# EAGLE design keyboardAV (EAGLE 7.3.0)
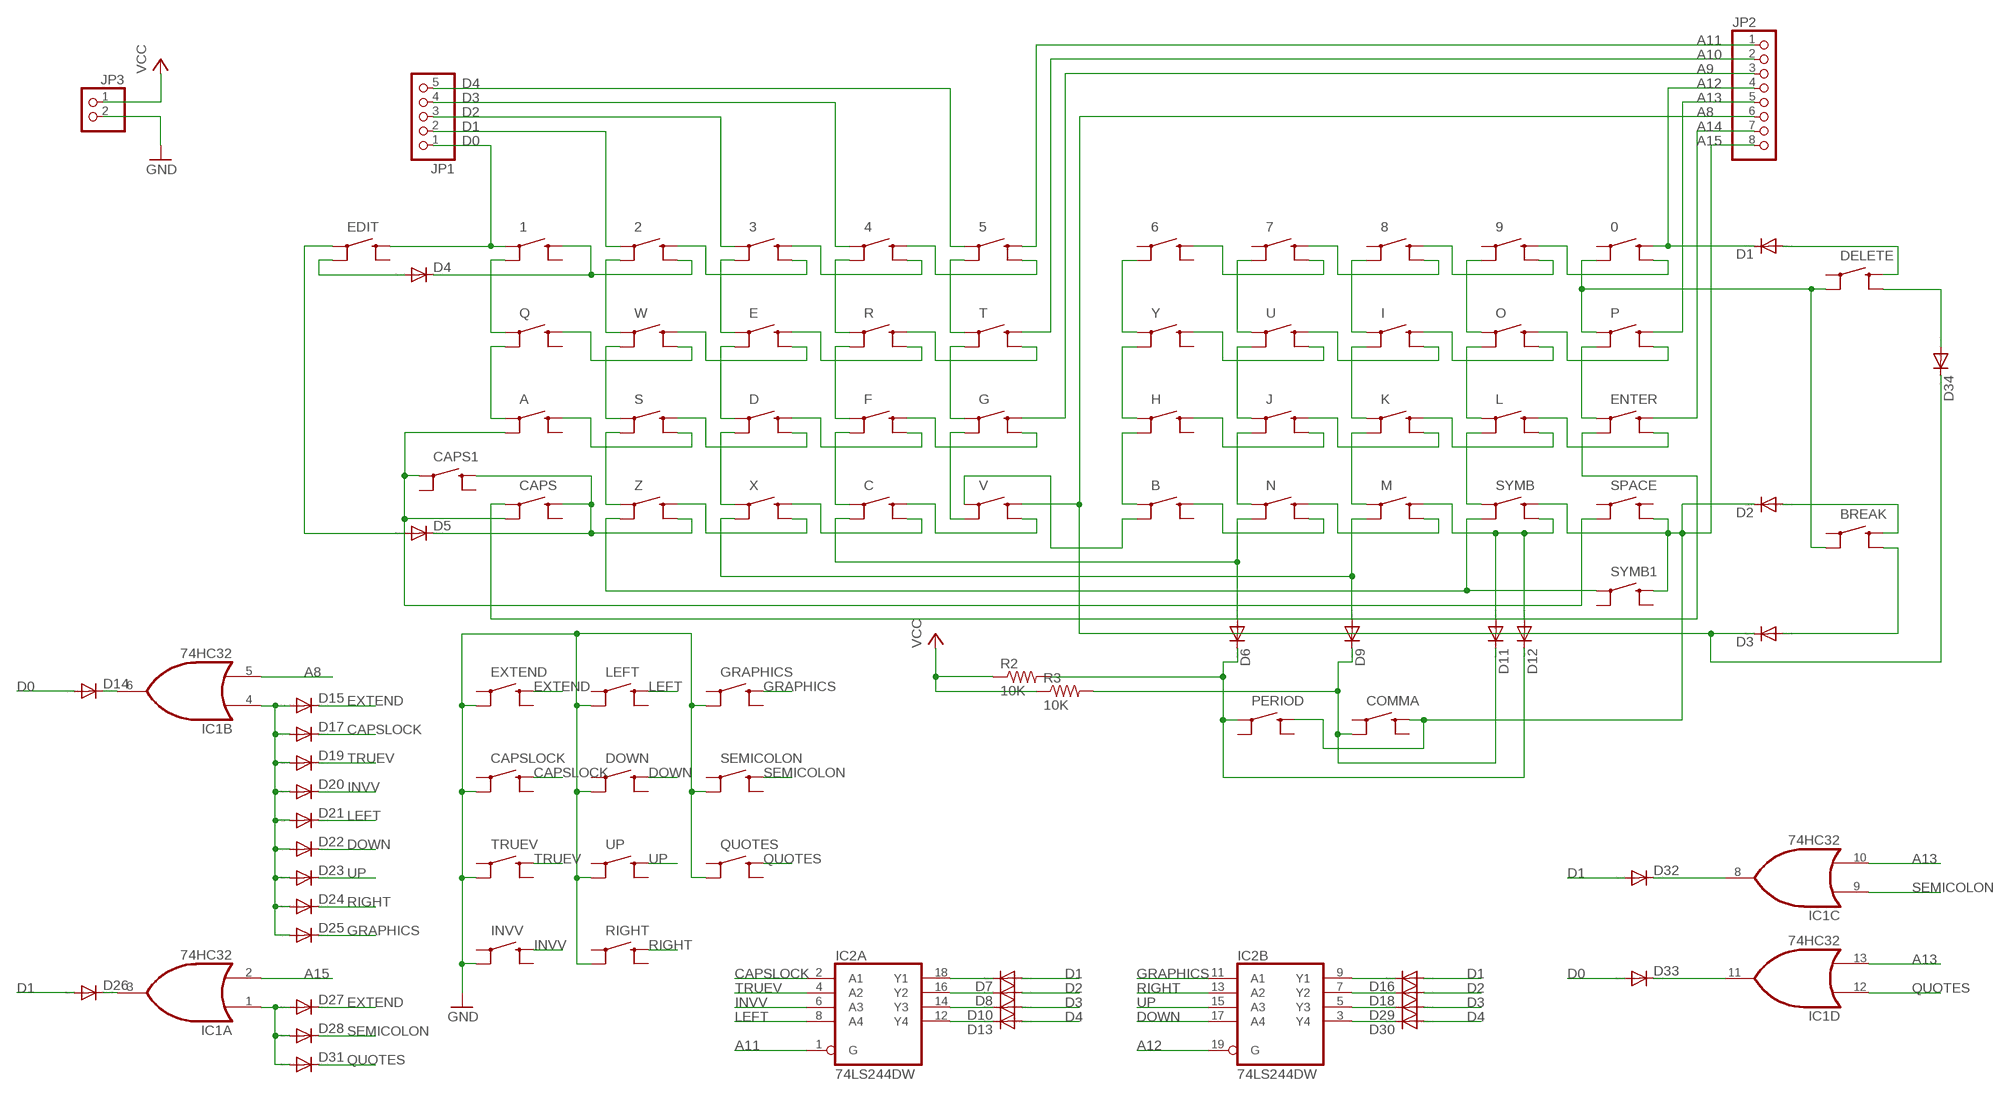
[diagram p0: schematic, sheet 1]

## Parts
0  SWITCH-MOMENTARY-2SMD  [TACTILE-SWITCH-SMD]
1  SWITCH-MOMENTARY-2SMD  [TACTILE-SWITCH-SMD]
2  SWITCH-MOMENTARY-2SMD  [TACTILE-SWITCH-SMD]
3  SWITCH-MOMENTARY-2SMD  [TACTILE-SWITCH-SMD]
4  SWITCH-MOMENTARY-2SMD  [TACTILE-SWITCH-SMD]
5  SWITCH-MOMENTARY-2SMD  [TACTILE-SWITCH-SMD]
6  SWITCH-MOMENTARY-2SMD  [TACTILE-SWITCH-SMD]
7  SWITCH-MOMENTARY-2SMD  [TACTILE-SWITCH-SMD]
8  SWITCH-MOMENTARY-2SMD  [TACTILE-SWITCH-SMD]
9  SWITCH-MOMENTARY-2SMD  [TACTILE-SWITCH-SMD]
A  SWITCH-MOMENTARY-2SMD  [TACTILE-SWITCH-SMD]
B  SWITCH-MOMENTARY-2SMD  [TACTILE-SWITCH-SMD]
BREAK  SWITCH-MOMENTARY-2SMD  [TACTILE-SWITCH-SMD]
C  SWITCH-MOMENTARY-2SMD  [TACTILE-SWITCH-SMD]
CAPS  SWITCH-MOMENTARY-2SMD  [TACTILE-SWITCH-SMD]
CAPS1  SWITCH-MOMENTARY-2SMD  [TACTILE-SWITCH-SMD]
CAPSLOCK  SWITCH-MOMENTARY-2SMD  [TACTILE-SWITCH-SMD]
COMMA  SWITCH-MOMENTARY-2SMD  [TACTILE-SWITCH-SMD]
D  SWITCH-MOMENTARY-2SMD  [TACTILE-SWITCH-SMD]
D1  DIODE-SOD323-R  [SOD323-R]
D2  DIODE-SOD323-R  [SOD323-R]
D3  DIODE-SOD323-R  [SOD323-R]
D4  DIODE-SOD323-R  [SOD323-R]
D5  DIODE-SOD323-R  [SOD323-R]
D6  DIODE-SOD323-R  [SOD323-R]
D7  DIODE-SOD323-R  [SOD323-R]
D8  DIODE-SOD323-R  [SOD323-R]
D9  DIODE-SOD323-R  [SOD323-R]
D10  DIODE-SOD323-R  [SOD323-R]
D11  DIODE-SOD323-R  [SOD323-R]
D12  DIODE-SOD323-R  [SOD323-R]
D13  DIODE-SOD323-R  [SOD323-R]
D14  DIODE-SOD323-R  [SOD323-R]
D15  DIODE-SOD323-R  [SOD323-R]
D16  DIODE-SOD323-R  [SOD323-R]
D17  DIODE-SOD323-R  [SOD323-R]
D18  DIODE-SOD323-R  [SOD323-R]
D19  DIODE-SOD323-R  [SOD323-R]
D20  DIODE-SOD323-R  [SOD323-R]
D21  DIODE-SOD323-R  [SOD323-R]
D22  DIODE-SOD323-R  [SOD323-R]
D23  DIODE-SOD323-R  [SOD323-R]
D24  DIODE-SOD323-R  [SOD323-R]
D25  DIODE-SOD323-R  [SOD323-R]
D26  DIODE-SOD323-R  [SOD323-R]
D27  DIODE-SOD323-R  [SOD323-R]
D28  DIODE-SOD323-R  [SOD323-R]
D29  DIODE-SOD323-R  [SOD323-R]
D30  DIODE-SOD323-R  [SOD323-R]
D31  DIODE-SOD323-R  [SOD323-R]
D32  DIODE-SOD323-R  [SOD323-R]
D33  DIODE-SOD323-R  [SOD323-R]
D34  DIODE-SOD323-R  [SOD323-R]
DELETE  SWITCH-MOMENTARY-2SMD  [TACTILE-SWITCH-SMD]
DOWN  SWITCH-MOMENTARY-2SMD  [TACTILE-SWITCH-SMD]
E  SWITCH-MOMENTARY-2SMD  [TACTILE-SWITCH-SMD]
EDIT  SWITCH-MOMENTARY-2SMD  [TACTILE-SWITCH-SMD]
ENTER  SWITCH-MOMENTARY-2SMD  [TACTILE-SWITCH-SMD]
EXTEND  SWITCH-MOMENTARY-2SMD  [TACTILE-SWITCH-SMD]
F  SWITCH-MOMENTARY-2SMD  [TACTILE-SWITCH-SMD]
G  SWITCH-MOMENTARY-2SMD  [TACTILE-SWITCH-SMD]
GRAPHICS  SWITCH-MOMENTARY-2SMD  [TACTILE-SWITCH-SMD]
H  SWITCH-MOMENTARY-2SMD  [TACTILE-SWITCH-SMD]
I  SWITCH-MOMENTARY-2SMD  [TACTILE-SWITCH-SMD]
IC1  74HC32  74S32D  [SO14]
IC2  74LS244DW  [SO20W]
INVV  SWITCH-MOMENTARY-2SMD  [TACTILE-SWITCH-SMD]
J  SWITCH-MOMENTARY-2SMD  [TACTILE-SWITCH-SMD]
JP1  PINHD-1X5  [1X05]
JP2  PINHD-1X8  [1X08]
JP3  PINHD-1X2  [1X02]
K  SWITCH-MOMENTARY-2SMD  [TACTILE-SWITCH-SMD]
L  SWITCH-MOMENTARY-2SMD  [TACTILE-SWITCH-SMD]
LEFT  SWITCH-MOMENTARY-2SMD  [TACTILE-SWITCH-SMD]
M  SWITCH-MOMENTARY-2SMD  [TACTILE-SWITCH-SMD]
N  SWITCH-MOMENTARY-2SMD  [TACTILE-SWITCH-SMD]
O  SWITCH-MOMENTARY-2SMD  [TACTILE-SWITCH-SMD]
P  SWITCH-MOMENTARY-2SMD  [TACTILE-SWITCH-SMD]
PERIOD  SWITCH-MOMENTARY-2SMD  [TACTILE-SWITCH-SMD]
Q  SWITCH-MOMENTARY-2SMD  [TACTILE-SWITCH-SMD]
QUOTES  SWITCH-MOMENTARY-2SMD  [TACTILE-SWITCH-SMD]
R  SWITCH-MOMENTARY-2SMD  [TACTILE-SWITCH-SMD]
R2  10K  R-US_M0805  [M0805]
R3  10K  R-US_M0805  [M0805]
RIGHT  SWITCH-MOMENTARY-2SMD  [TACTILE-SWITCH-SMD]
S  SWITCH-MOMENTARY-2SMD  [TACTILE-SWITCH-SMD]
SEMICOLON  SWITCH-MOMENTARY-2SMD  [TACTILE-SWITCH-SMD]
SPACE  SWITCH-MOMENTARY-2SMD  [TACTILE-SWITCH-SMD]
SYMB  SWITCH-MOMENTARY-2SMD  [TACTILE-SWITCH-SMD]
SYMB1  SWITCH-MOMENTARY-2SMD  [TACTILE-SWITCH-SMD]
T  SWITCH-MOMENTARY-2SMD  [TACTILE-SWITCH-SMD]
TRUEV  SWITCH-MOMENTARY-2SMD  [TACTILE-SWITCH-SMD]
U  SWITCH-MOMENTARY-2SMD  [TACTILE-SWITCH-SMD]
UP  SWITCH-MOMENTARY-2SMD  [TACTILE-SWITCH-SMD]
V  SWITCH-MOMENTARY-2SMD  [TACTILE-SWITCH-SMD]
W  SWITCH-MOMENTARY-2SMD  [TACTILE-SWITCH-SMD]
X  SWITCH-MOMENTARY-2SMD  [TACTILE-SWITCH-SMD]
Y  SWITCH-MOMENTARY-2SMD  [TACTILE-SWITCH-SMD]
Z  SWITCH-MOMENTARY-2SMD  [TACTILE-SWITCH-SMD]

## Nets
A8: D3.C D34.C IC1.5(B:I1) JP2.6 V.3
A9: G.3 JP2.3
A10: JP2.2 T.3
A11: 5.3 IC2.1(A:G) JP2.1
A12: 0.3 D1.C IC2.19(B:G) JP2.4
A13: IC1.10(C:I1) IC1.13(D:I1) JP2.5 P.3
A14: ENTER.3 JP2.7
A15: COMMA.3 D2.C IC1.2(A:I1) JP2.8 PERIOD.3 SPACE.4 SYMB1.3 SYMB.3
CAPSLOCK: CAPSLOCK.3 D17.C IC2.2(A:A1)
D0: 1.1 D14.A D33.A EDIT.3 JP1.1
D1: 2.1 D7.A D16.A D26.A D32.A JP1.2
D2: 3.1 D8.A D18.A JP1.3
D3: 4.1 D10.A D29.A JP1.4
D4: 5.1 D13.A D30.A JP1.5
DOWN: D22.C DOWN.3 IC2.17(B:A4)
EXTEND: D15.C D27.C EXTEND.3
GND: CAPSLOCK.2 DOWN.2 EXTEND.2 GRAPHICS.2 INVV.2 JP3.2 LEFT.2 QUOTES.2 RIGHT.2 SEMICOLON.2 TRUEV.2 UP.2
GRAPHICS: D25.C GRAPHICS.3 IC2.11(B:A1)
INVV: D20.C IC2.6(A:A3) INVV.3
LEFT: D21.C IC2.8(A:A4) LEFT.3
N$1: D4.A EDIT.2
N$2: D5.A EDIT.1
N$3: BREAK.3 D2.A
N$4: BREAK.4 D3.A
N$5: D1.A DELETE.3
N$6: 1.2 Q.1
N$7: A.1 Q.2
N$9: CAPS.1 ENTER.2
N$10: B.1 H.2
N$11: H.1 Y.2
N$12: 6.2 Y.1
N$13: 2.2 W.1
N$14: S.1 W.2
N$15: S.2 Z.1
N$16: SYMB1.1 SYMB.2 Z.2
N$17: D9.A M.2 X.2
N$18: C.2 D6.A N.2
N$19: B.2 V.1
N$20: 3.2 E.1
N$21: D.1 E.2
N$22: D.2 X.1
N$23: 4.2 R.1
N$24: F.1 R.2
N$25: C.1 F.2
N$26: 5.2 T.1
N$27: G.1 T.2
N$28: G.2 V.2
N$29: 3.3 4.4
N$30: 4.3 5.4
N$31: 2.3 3.4
N$32: 1.3 2.4 D4.C
N$33: C.3 V.4
N$34: R.3 T.4
N$35: E.3 R.4
N$36: E.4 W.3
N$37: Q.3 W.4
N$38: F.3 G.4
N$39: D.3 F.4
N$40: D.4 S.3
N$41: A.3 S.4
N$42: 0.4 9.3
N$43: J.2 N.1
N$44: J.1 U.2
N$45: 7.2 U.1
N$46: K.2 M.1
N$47: I.2 K.1
N$48: 8.2 I.1
N$49: L.2 SYMB.1
N$50: L.1 O.2
N$51: 9.2 O.1
N$53: ENTER.1 P.2
N$54: 0.2 BREAK.2 DELETE.2 P.1
N$55: 8.3 9.4
N$56: 7.3 8.4
N$57: 6.3 7.4
N$58: C.4 X.3
N$59: X.4 Z.3
N$60: CAPS1.3 CAPS.3 D5.C Z.4
N$61: O.3 P.4
N$62: I.3 O.4
N$63: I.4 U.3
N$64: U.4 Y.3
N$65: ENTER.4 L.3
N$66: K.3 L.4
N$67: J.3 K.4
N$68: H.3 J.4
N$70: D11.A D12.A M.3 SYMB.4
N$71: M.4 N.3
N$72: B.3 N.4
N$73: D34.A DELETE.4
N$74: D7.C IC2.18(A:Y1)
N$75: D8.C IC2.16(A:Y2)
N$77: D10.C IC2.14(A:Y3)
N$79: D6.C D12.C PERIOD.1 R2.2
N$80: D13.C IC2.12(A:Y4)
N$81: D16.C IC2.9(B:Y1)
N$83: COMMA.2 D9.C D11.C R3.2
N$84: D14.C IC1.6(B:O)
N$85: D18.C IC2.7(B:Y2)
N$86: D26.C IC1.3(A:O)
N$87: D27.A D28.A D31.A IC1.1(A:I0)
N$88: D29.C IC2.5(B:Y3)
N$89: D30.C IC2.3(B:Y4)
N$90: D15.A D17.A D19.A D20.A D21.A D22.A D23.A D24.A D25.A IC1.4(B:I0)
N$91: A.2 CAPS1.1 CAPS.2 SPACE.2
N$108: D32.C IC1.8(C:O)
N$114: D33.C IC1.11(D:O)
QUOTES: D31.C IC1.12(D:I0) QUOTES.3
RIGHT: D24.C IC2.13(B:A2) RIGHT.3
SEMICOLON: D28.C IC1.9(C:I0) SEMICOLON.3
TRUEV: D19.C IC2.4(A:A2) TRUEV.3
UP: D23.C IC2.15(B:A3) UP.3
VCC: JP3.1 R2.1 R3.1
Unconnected: 0.1 1.4 6.1 6.4 7.1 8.1 9.1 A.4 B.4 BREAK.1 CAPS1.2 CAPS1.4 CAPS.4 CAPSLOCK.1 CAPSLOCK.4 COMMA.1 COMMA.4 DELETE.1 DOWN.1 DOWN.4 EDIT.4 EXTEND.1 EXTEND.4 GRAPHICS.1 GRAPHICS.4 H.4 INVV.1 INVV.4 LEFT.1 LEFT.4 PERIOD.2 PERIOD.4 Q.4 QUOTES.1 QUOTES.4 RIGHT.1 RIGHT.4 SEMICOLON.1 SEMICOLON.4 SPACE.1 SPACE.3 SYMB1.2 SYMB1.4 TRUEV.1 TRUEV.4 UP.1 UP.4 Y.4

## Power pins joined to a net without a drawn wire
GND: IC1.7(P:GND) IC2.10(P:GND)
VCC: IC1.14(P:VCC) IC2.20(P:VCC)

## Library data of the parts
0 1-9 A B BREAK C CAPS CAPS1 CAPSLOCK COMMA D DELETE DOWN E EDIT ENTER EXTEND F G GRAPHICS H I INVV J K L LEFT M N O P PERIOD Q QUOTES R RIGHT S SEMICOLON SPACE SYMB SYMB1 T TRUEV U UP V W X Y Z = SparkFun-Electromechanical:SWITCH-MOMENTARY-2: Various NO switches- pushbuttons, reed, etc; PROD_ID: SWCH-08247
D1-D34 = diode:DIODE-: DIODE
IC1 = 74xx-us:74*32: Quad 2-input OR gate
IC2 = 74xx-us:74*244: Octal BUFFER and LINE DRIVER, 3-state
JP1 = pinhead:PINHD-1X5: PIN HEADER
JP2 = pinhead:PINHD-1X8: PIN HEADER
JP3 = pinhead:PINHD-1X2: PIN HEADER
R2 R3 = rcl:R-US_: RESISTOR, American symbol

## Board
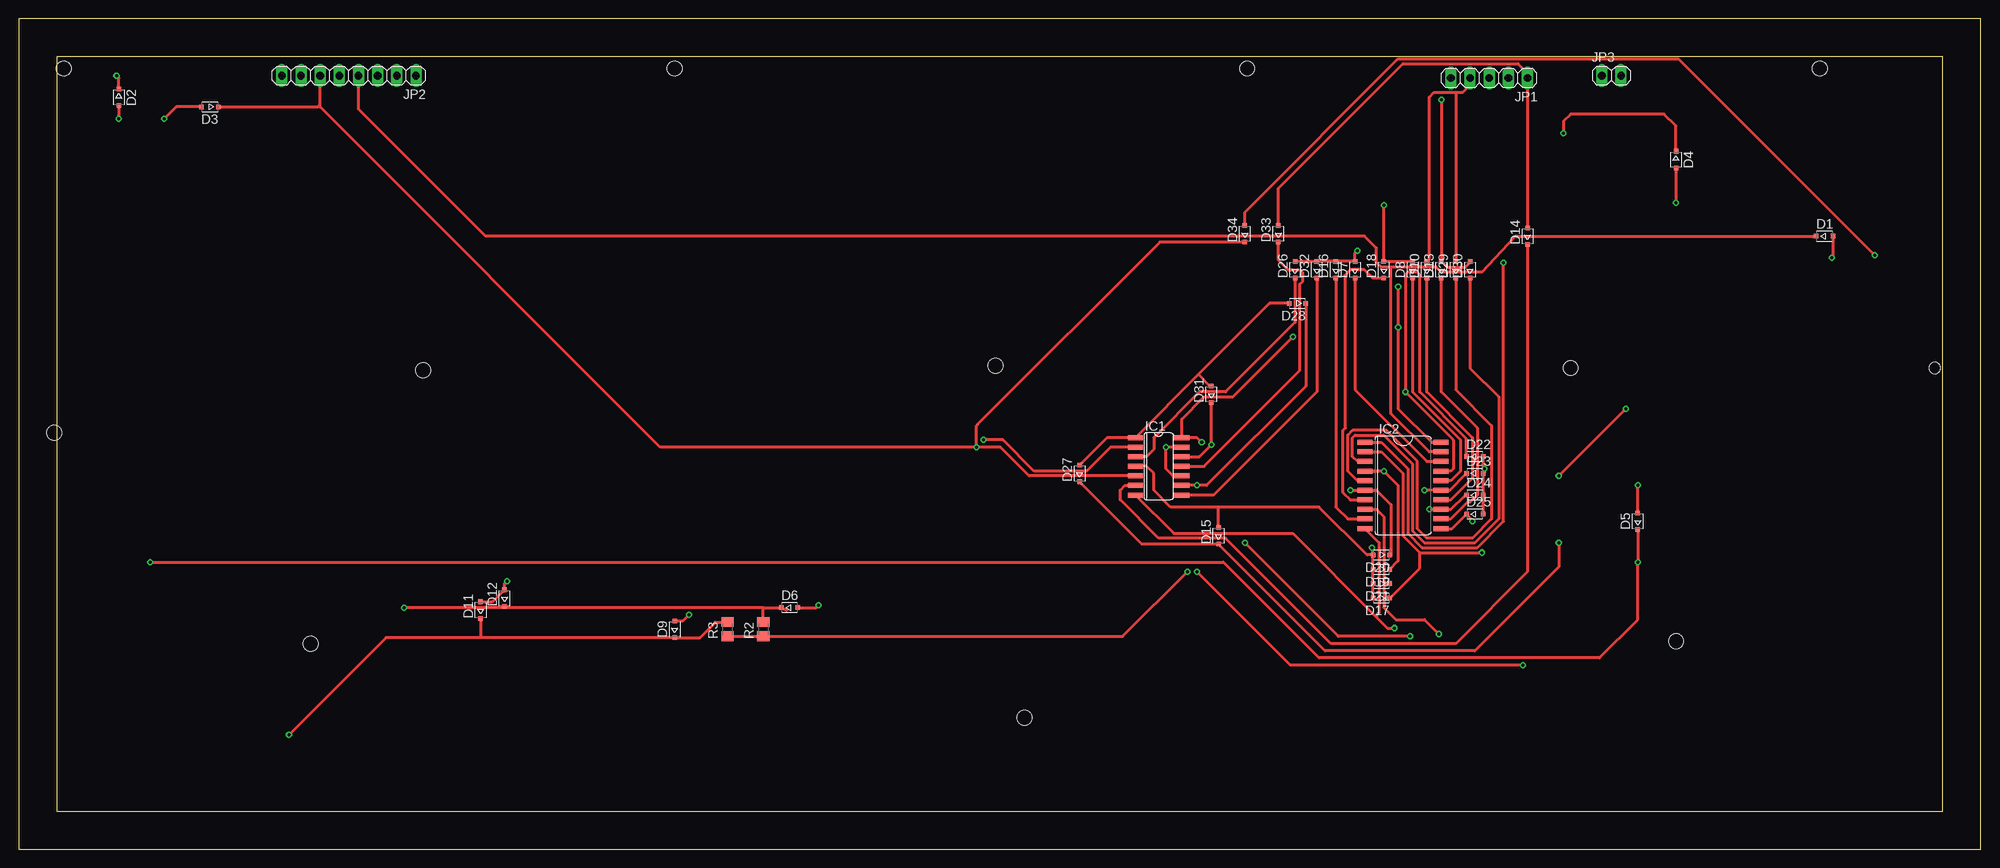
[diagram p1: board, top side]
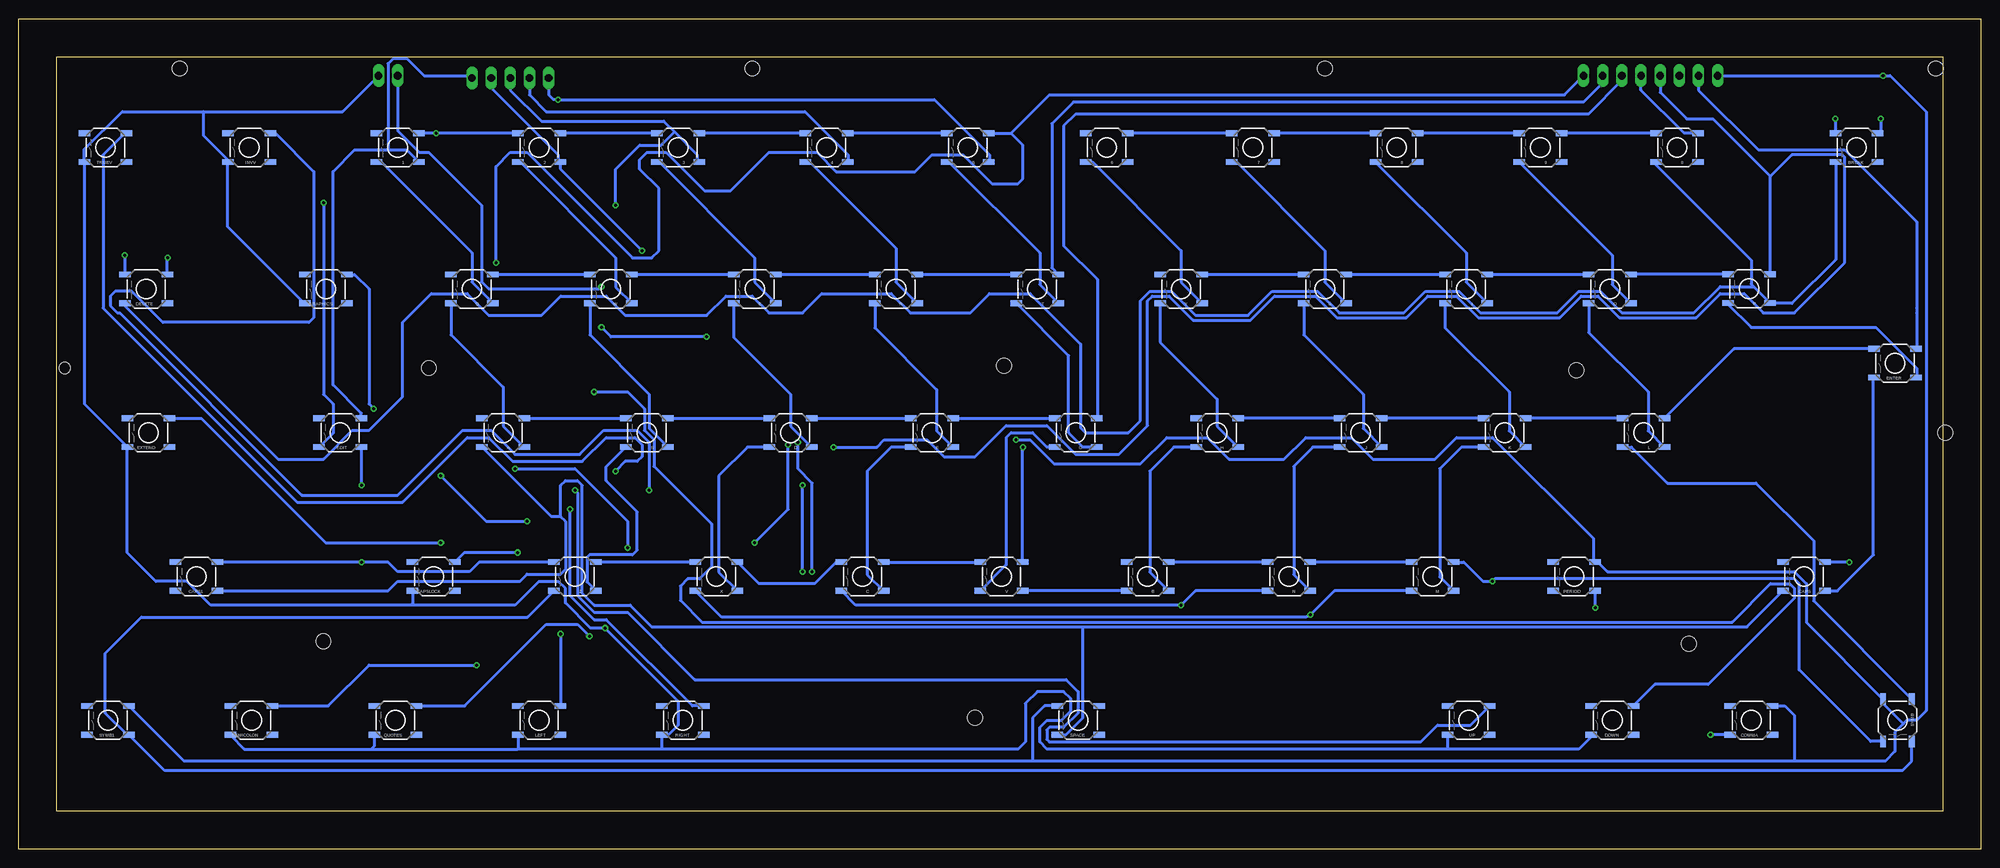
[diagram p2: board, bottom side, seen from below]

Size 260 x 110 mm. Coordinates in mm from the lower left corner, seen from the top.
Outline: 0,0 260,0 260,110 0,110 0,0
Copper layers (1*16): Top 0.035mm / dielectric 1.5mm / Bottom 0.035mm
Design rules "default": minimum track width 10mil, minimum drill 24mil, track to track 8mil, track to pad 8mil, pad to pad 8mil, via to via 8mil, smd to smd 8mil, copper to edge 40mil, drill to drill 8mil, minimum pad ring 10mil, minimum via ring 8mil, stop-mask expansion 4mil, vias tented up to drill 0mil, thermal gap 10mil
Holes 2 mm at 38.66,27.23 133.27,17.38 219.63,27.54 205.66,63.74 129.46,64.06 53.58,63.42 5.95,103.42 86.92,103.42 162.8,103.42 238.68,103.42 4.68,55.16
Holes 1.5 mm at 253.92,63.74
Milling: 4 lines

### Footprints (pad centres in the part's own frame; a part is rotated, then mirrored left to right if it is on the bottom)
TACTILE-SWITCH-SMD = smd 1.524 x 0.762: 1 -2.794,1.905; 2 2.794,1.905; 3 -2.794,-1.905; 4 2.794,-1.905
SOD323-R = smd 0.6 x 0.6: A 1.1,0; C -1.1,0
SO14 = smd 0.66 x 2.032: 1 -3.81,-3.073; 2 -2.54,-3.073; 3 -1.27,-3.073; 4 0,-3.073; 5 1.27,-3.073; 6 2.54,-3.073; 7 3.81,-3.073; 8 3.81,3.073; 9 2.54,3.073; 10 1.27,3.073; 11 0,3.073; 12 -1.27,3.073; 13 -2.54,3.073; 14 -3.81,3.073
SO20W = smd 0.66 x 2.032: 1 -5.715,-5.029; 2 -4.445,-5.029; 3 -3.175,-5.029; 4 -1.905,-5.029; 5 -0.635,-5.029; 6 0.635,-5.029; 7 1.905,-5.029; 8 3.175,-5.029; 9 4.445,-5.029; 10 5.715,-5.029; 11 5.715,5.029; 12 4.445,5.029; 13 3.175,5.029; 14 1.905,5.029; 15 0.635,5.029; 16 -0.635,5.029; 17 -1.905,5.029; 18 -3.175,5.029; 19 -4.445,5.029; 20 -5.715,5.029
1X05 = drill 1.016 long: 1 -5.08,0; 2 -2.54,0; 3 0,0; 4 2.54,0; 5 5.08,0
1X08 = drill 1.016 long: 1 -8.89,0; 2 -6.35,0; 3 -3.81,0; 4 -1.27,0; 5 1.27,0; 6 3.81,0; 7 6.35,0; 8 8.89,0
1X02 = drill 1.016 long: 1 -1.27,0; 2 1.27,0
M0805 = smd 1.3 x 1.6: 1 -0.95,0; 2 0.95,0

### Placement (x,y rotation side)
0  40.24,92.95 180 bottom
1  209.79,92.95 180 bottom
2  191.06,92.95 180 bottom
3  172.64,92.95 180 bottom
4  152.96,92.95 180 bottom
5  134.22,92.95 180 bottom
6  115.81,92.95 180 bottom
7  96.44,92.95 180 bottom
8  77.39,92.95 180 bottom
9  58.34,92.95 180 bottom
A  195.82,55.16 180 bottom
B  110.41,36.11 180 bottom
BREAK  16.43,92.95 180 bottom
C  148.19,36.11 180 bottom
CAPS  23.41,36.11 180 bottom
CAPS1  236.46,36.11 180 bottom
CAPSLOCK  205.03,36.11 180 bottom
COMMA  30.4,17.06 180 bottom
D  157.72,55.16 180 bottom
D1  239.31,81.2 0 top
D2  13.26,99.61 270 top
D3  25.32,98.34 180 top
D4  219.63,91.36 270 top
D5  214.55,43.42 90 top
D6  102.16,31.99 0 top
D7  177.09,76.75 90 top
D8  184.71,76.75 90 top
D9  86.92,29.13 90 top
D10  186.61,76.75 90 top
D11  61.2,31.67 90 top
D12  64.37,33.26 90 top
D13  188.51,76.75 90 top
D14  199.94,81.2 90 top
D15  158.99,41.51 90 top
D16  174.54,76.75 90 top
D17  180.58,33.26 180 top
D18  180.9,76.75 90 top
D19  180.58,37.07 180 top
D20  180.58,38.97 180 top
D21  180.58,35.16 180 top
D22  192.96,51.99 0 top
D23  192.96,49.77 0 top
D24  192.96,46.91 0 top
D25  192.96,44.37 0 top
D26  169.15,76.75 90 top
D27  140.57,49.77 90 top
D28  169.47,72.31 180 top
D29  190.42,76.75 90 top
D30  192.32,76.75 90 top
D31  158.03,60.24 90 top
D32  172,76.75 90 top
D33  166.93,81.52 90 top
D34  162.48,81.52 90 top
DELETE  243.12,74.22 180 bottom
DOWN  48.81,17.06 180 bottom
E  162.48,74.22 180 bottom
EDIT  217.41,55.16 180 bottom
ENTER  11.35,64.37 180 bottom
EXTEND  242.81,55.16 180 bottom
F  138.99,55.16 180 bottom
G  119.94,55.16 180 bottom
GRAPHICS  219.31,74.22 180 bottom
H  101.2,55.16 180 bottom
I  68.18,74.22 180 bottom
IC1  151.05,50.72 270 top
IC2  183.44,48.18 270 top
INVV  229.47,92.95 180 bottom
J  82.15,55.16 180 bottom
JP1  194.87,102.16 180 top
JP2  43.73,102.47 180 top
JP3  211.06,102.47 0 top
K  63.1,55.16 180 bottom
L  44.69,55.16 180 bottom
LEFT  191.06,17.06 180 bottom
M  72.63,36.11 180 bottom
N  91.68,36.11 180 bottom
O  49.13,74.22 180 bottom
P  30.69,74.25 180 bottom
PERIOD  53.9,36.11 180 bottom
Q  199.94,74.22 180 bottom
QUOTES  210.1,17.06 180 bottom
R  143.75,74.22 180 bottom
R2  98.66,29.13 90 top
R3  93.9,29.13 90 top
RIGHT  172,17.06 180 bottom
S  176.77,55.16 180 bottom
SEMICOLON  229.16,17.06 180 bottom
SPACE  119.62,17.06 180 bottom
SYMB  11.03,17.06 270 bottom
SYMB1  248.21,17.06 180 bottom
T  125.02,74.22 180 bottom
TRUEV  248.52,92.95 180 bottom
U  86.92,74.22 180 bottom
UP  67.87,17.06 180 bottom
V  129.78,36.11 180 bottom
W  181.53,74.22 180 bottom
X  167.56,36.11 180 bottom
Y  105.97,74.22 180 bottom
Z  186.29,36.11 180 bottom

### Tracks (layer width: path | path; a pad name or v marks a point on that pad's centre or on a via)
A8  (via drill 0.4)
  Top 0.406: v126.92,53.26 85.01,53.26 39.92,98.34 39.92,98.66 | 39.92,98.66 JP2.6 | D3.C 39.61,98.34 39.92,98.66 | IC1.5 133.91,49.45 130.09,53.26 v126.92,53.26 | D34.C 151.22,80.42 127.08,56.28 126.92,56.12 v126.92,53.26
  Bottom 0.406: V.3 126.98,53.2 v126.92,53.26
A9
  Bottom 0.406: JP2.3 47.55,101.84 51.99,97.39 119.94,97.39 121.52,95.81 121.52,79.93 117.08,75.48 117.08,57.13 G.3
A10
  Bottom 0.406: JP2.2 50.09,101.52 52.62,98.98 120.25,98.98 123.11,96.12 123.11,77.01 T.3
A11  (via drill 0.4)
  Top 0.406: IC2.1 180.58,53.9 184.07,50.4 184.07,41.83 185.97,39.92 193.28,39.92 196.77,43.42 v196.77,77.71
  Bottom 0.406: 5.3 128.51,94.85 | 128.51,94.85 123.43,99.93 55.16,99.93 JP2.1 | v196.77,77.71 196.77,90.41 194.87,92.31 192.64,92.31 178.67,78.34 176.13,78.34 175.18,79.3 175.18,87.55 177.72,90.09 177.72,91.36 176.77,92.31 174.23,92.31 169.15,87.23 165.66,87.23 160.57,92.31 154.22,92.31 151.69,89.77 141.21,89.77 138.99,92 134.86,92 131.05,88.19 127.56,88.19 126.92,88.82 126.92,93.27 128.51,94.85
A12
  Top 0.406: JP2.4 45.01,98.03 61.83,81.2 178.35,81.2 179.94,79.61 179.94,77.71 180.58,77.07 181.85,77.07 | D1.C 198.36,81.2 193.91,76.44 188.51,76.44 187.88,77.07 181.85,77.07 | IC2.19 186.93,52.62 181.85,57.7 181.85,77.07
  Bottom 0.406: 0.3 39.29,94.85 45.01,100.57 JP2.4
A13  (via drill 0.4)
  Top 0.406: IC1.13 v152,53.26 152,50.4 152.96,49.45 IC1.10
  Bottom 0.406: JP2.5 42.47,100.25 38.97,96.76 35.48,96.76 27.86,89.14 | P.3 27.89,89.11 27.86,89.14 | v152,53.26 146.29,53.26 145.34,54.21 139.62,54.21 137.4,51.99 133.27,51.99 129.14,56.12 123.75,56.12 119.94,52.31 114.22,52.31 110.41,56.12 110.41,72.63 109.78,73.26 107.55,73.26 104.38,70.09 96.76,70.09 93.58,73.26 88.19,73.26 85.33,70.41 76.12,70.41 73.26,73.26 69.45,73.26 66.59,70.41 55.8,70.41 52.94,73.26 50.72,73.26 47.86,70.41 37.7,70.41 34.53,73.58 31.35,73.58 28.81,71.04 24.68,71.04 18.02,77.71 18.02,91.68 18.34,92 25,92 27.86,89.14
A14
  Bottom 0.406: JP2.7 37.38,100.57 29.45,92.63 18.02,92.63 8.49,83.11 8.49,71.67 8.49,71.04 8.49,66.34 ENTER.3
A15  (via drill 0.4)
  Top 0.406: D2.C 13.26,102.16 v12.94,102.47 | IC1.2 144.7,53.26 141.53,50.09 134.54,50.09 130.41,54.21 v127.87,54.21
  Bottom 0.406: JP2.8 v12.94,102.47 11.98,102.47 7.22,97.71 7.22,18.34 8.49,17.06 9.76,17.06 10.24,16.59 | 10.24,16.59 11.35,15.48 11.35,12.94 12.62,11.67 24.68,11.67 | 10.24,16.59 12.94,19.29 SYMB.3 23.1,30.02 23.1,35.16 24.68,36.75 49.45,36.75 50.72,38.02 PERIOD.3 51.35,38.27 51.35,41.2 64.69,54.53 69.45,54.53 72.31,51.67 80.56,51.67 83.42,54.53 89.45,54.53 92.31,51.67 99.61,51.67 102.47,54.53 107.87,54.53 111.36,51.04 122.79,51.04 125.97,54.21 v127.87,54.21 | 24.68,11.67 125.65,11.67 | 125.65,11.67 238.11,11.67 SYMB1.3 | 125.65,11.67 125.65,17.38 124.06,18.97 SPACE.4 | 24.68,11.67 24.68,17.7 25.95,18.97 COMMA.3
CAPSLOCK  (via drill 0.4)
  Top 0.406: IC2.2 180.58,52.62 183.44,49.77 183.44,41.51 185.66,39.29 | 185.66,39.29 v193.91,39.29 | D17.C 185.66,37.24 185.66,39.29
  Bottom 0.406: 201.85,38.02 CAPSLOCK.3 200.96,39.29 v193.91,39.29
D0
  Top 0.406: D33.A 166.93,87.55 183.44,104.06 198.68,104.06 199.94,102.79 JP1.1 D14.A
  Bottom 0.406: EDIT.3 214.61,57.77 218.36,61.52 218.36,89.77 215.5,92.63 211.06,92.63 | 211.06,92.63 208.58,92.63 1.1 | 211.06,92.63 211.06,104.06 210.42,104.69 208.52,104.69 206.29,102.47 200.26,102.47 JP1.1
D1  (via drill 0.4)
  Top 0.406: v177.4,79.3 177.09,78.98 D7.A D16.A D32.A D26.A
  Bottom 0.406: JP1.2 197.41,100.89 188.51,92 188.51,91.3 2.1 188.26,90.15 v177.4,79.3
D2  (via drill 0.4)
  Top 0.406: D8.A D18.A v180.9,85.33
  Bottom 0.406: JP1.3 194.87,100.57 190.74,96.44 174.54,96.44 173.12,95.01 | 173.12,95.01 170.1,92 170.1,91.3 3.1 | v180.9,85.33 180.9,90.09 177.72,93.27 174.86,93.27 173.12,95.01
D3
  Top 0.406: D10.A 186.93,78.17 186.93,99.61 187.56,100.25 190.42,100.25 | 190.42,100.25 191.37,100.25 192.32,101.2 JP1.4 | 190.42,100.25 D29.A
  Bottom 0.406: JP1.4 192.32,99.93 190.1,97.71 155.81,97.71 150.1,92 150.1,91.11 4.1
D4  (via drill 0.4)
  Top 0.406: v188.51,99.3 D13.A 189.3,77.07 191.69,77.07 192.32,77.71 D30.A
  Bottom 0.406: JP1.5 189.78,99.93 189.15,99.3 v188.51,99.3 138.67,99.3 131.37,92 131.37,91.11 5.1
DOWN  (via drill 0.4)
  Top 0.406: D22.C 191.86,54.36 185.66,60.56 185.66,76.12 185.34,76.44 184.07,76.44 183.75,76.12 v183.75,60.56 190.1,54.21 190.1,50.4 189.78,50.09 IC2.17
  Bottom 0.406: v183.75,60.56 179.31,60.56 177.09,58.34 177.09,55.48 175.81,54.21 175.81,50.72 168.19,43.1 168.19,37.38 169.78,35.8 171.37,35.8 172.32,34.84 172.32,32.94 169.47,30.08 32.94,30.08 27.86,35.16 25.32,35.16 24.68,34.53 24.68,33.26 36.11,21.83 43.16,21.83 DOWN.3
EXTEND  (via drill 0.4)
  Top 0.406: D27.C 148.83,40.41 D15.C 173.13,26.27 192.96,26.27 204.07,37.38 v204.07,40.56
  Bottom 0.406: EXTEND.3 235.82,57.07 219.31,40.56 v204.07,40.56
GND  (via drill 0.4)
  Top 0.406: IC1.7 153.06,41.83 168.83,41.83 179.94,30.72 | 179.94,30.72 181.37,29.29 v182.32,29.29 | IC2.10 180.26,40.61 180.26,31.35 179.94,31.04 179.94,30.72
  Bottom 0.406: 235.5,97.71 246.3,97.71 251.32,92.69 TRUEV.2 251.32,58.98 EXTEND.2 245.66,53.2 245.66,39.29 241.85,35.48 237.73,35.48 234.55,32.3 207.56,32.3 | 235.5,97.71 217.09,97.71 JP3.2 | 235.5,97.71 235.5,94.53 232.27,91.3 INVV.2 232.33,90.98 232.33,82.47 222.17,72.31 GRAPHICS.2 | SEMICOLON.2 231.95,15.1 230.11,13.26 213.28,13.26 | 213.28,13.26 193.91,13.26 | LEFT.2 193.85,13.32 193.91,13.26 | QUOTES.2 212.9,13.64 213.28,13.26 | RIGHT.2 174.86,15.16 | 207.56,32.3 194.23,32.3 191.06,35.48 188.51,35.48 187.56,34.53 187.56,32.62 184.23,29.29 v182.32,29.29 172.64,19.61 172.64,16.43 173.91,15.16 RIGHT.2 | CAPSLOCK.2 207.82,32.56 207.56,32.3 | DOWN.2 51.61,14.91 53.26,13.26 70.72,13.26 | 70.72,13.26 123.75,13.26 124.7,14.21 124.7,16.11 123.75,17.06 121.84,17.06 120.57,18.34 120.57,19.92 121.52,20.88 125.02,20.88 126.6,19.29 126.6,14.21 127.56,13.26 174.86,13.26 | 174.86,13.26 193.91,13.26 | RIGHT.2 174.8,13.32 174.86,13.26 | 70.72,13.26 70.66,13.32 UP.2
GRAPHICS  (via drill 0.4)
  Top 0.406: IC2.11 189.96,42.47 D25.C 192.64,43.59 v192.64,43.42 | v212.96,58.34 v204.07,49.45
  Bottom 0.406: GRAPHICS.3 215.5,76.12 213.6,74.22 213.6,58.98 v212.96,58.34 | v204.07,49.45 198.04,43.42 v192.64,43.42
INVV  (via drill 0.4)
  Top 0.406: D20.C 181.85,38.8 181.85,45.64 179.94,47.55 IC2.6 v176.45,47.55
  Bottom 0.406: INVV.3 225.98,94.85 220.9,89.77 220.9,70.41 221.53,69.77 240.9,69.77 245.03,73.9 247.25,73.9 247.89,73.26 247.89,71.99 246.94,71.04 246.62,71.04 222.49,46.91 209.79,46.91 201.22,55.48 197.41,55.48 194.23,52.31 185.66,52.31 182.48,55.48 178.04,55.48 176.45,53.9 v176.45,47.55
LEFT  (via drill 0.4)
  Top 0.406: IC2.8 179.94,45.01 180.9,44.05 180.9,35.16 | D21.C 180.9,35.16 | 180.9,35.16 180.9,31.99 182.48,30.4 186.29,30.4 v188.2,28.5
  Bottom 0.406: v188.2,28.5 188.2,19.03 LEFT.3
N$1  (via drill 0.4)
  Top 0.406: D4.A v219.63,85.64
  Bottom 0.406: v219.63,85.64 219.63,60.24 218.36,58.98 218.36,55.1 EDIT.2
N$2  (via drill 0.4)
  Top 0.406: D5.A v214.55,48.18
  Bottom 0.406: v214.55,48.18 214.55,53.2 EDIT.1
N$3  (via drill 0.4)
  Top 0.406: D2.A v13.26,96.76
  Bottom 0.406: v13.26,96.76 13.26,95.23 BREAK.3
N$4  (via drill 0.4)
  Top 0.406: D3.A 20.88,98.34 v19.29,96.76
  Bottom 0.406: v19.29,96.76 19.29,94.92 BREAK.4
N$5  (via drill 0.4)
  Top 0.406: D1.A 240.41,78.49 v240.27,78.34
  Bottom 0.406: DELETE.3 240.33,78.03 | 240.33,78.03 240.33,78.28 v240.27,78.34 240.27,78.09 240.33,78.03
N$6
  Bottom 0.406: 1.2 212.01,91.04 199.94,78.98 199.94,75.1 Q.1
N$7
  Bottom 0.406: Q.2 202.74,68.12 195.82,61.2 195.82,56.05 A.1
N$9
  Bottom 0.406: CAPS.1 18.97,34.21 14.21,38.97 14.21,62.4 ENTER.2
N$10
  Bottom 0.406: H.2 106.92,53.26 110.09,50.09 110.09,36.69 B.1
N$11
  Bottom 0.406: Y.2 108.76,67.17 101.2,59.61 101.2,56.05 H.1
N$12
  Bottom 0.406: 6.2 117.71,91.04 105.97,79.3 105.97,75.1 Y.1
N$13
  Bottom 0.406: 2.2 193.59,91.04 180.9,78.34 180.9,74.47 W.1
N$14
  Bottom 0.406: W.2 184.32,68.12 176.45,60.24 176.45,55.74 S.1
N$15
  Bottom 0.406: S.2 182.16,50.66 182.16,48.81 178.04,44.69 178.04,39.61 178.67,38.97 184.39,38.97 184.71,38.66 184.71,35.42 Z.1
N$16
  Bottom 0.406: Z.2 192.58,30.72 243.76,30.72 248.52,25.95 248.52,18.02 245.66,15.16 SYMB1.1 240.65,10.4 10.4,10.4 9.13,11.67 SYMB.2
N$17  (via drill 0.4)
  Top 0.406: D9.A 88.02,30.23 v88.82,31.04
  Bottom 0.406: M.2 85.64,34.21 v88.82,31.04 89.45,30.72 166.86,30.72 X.2
N$18  (via drill 0.4)
  Top 0.406: D6.A 105.65,31.99 v105.97,32.3
  Bottom 0.406: N.2 104.06,34.21 v105.97,32.3 149.08,32.3 C.2
N$19
  Bottom 0.406: B.2 V.1
N$20
  Bottom 0.406: 3.2 175.18,91.04 162.48,78.34 162.48,75.1 E.1
N$21
  Bottom 0.406: E.2 165.27,67.8 157.72,60.24 157.72,56.05 D.1
N$22
  Bottom 0.406: D.2 163.43,53.26 167.24,49.45 167.24,36.69 X.1
N$23
  Bottom 0.406: 4.2 155.18,91.04 143.75,79.61 143.75,75.1 R.1
N$24
  Bottom 0.406: R.2 146.54,69.07 138.35,60.88 138.35,55.42 F.1
N$25
  Bottom 0.406: F.2 144.38,53.26 147.56,50.09 147.56,36.37 C.1
N$26
  Bottom 0.406: 5.2 136.76,91.04 124.7,78.98 124.7,74.79 T.1
N$27
  Bottom 0.406: G.1 118.98,53.26 120.89,55.16 120.89,65.39 T.2
N$28
  Bottom 0.406: G.2 123.75,53.26 125.65,55.16 128.51,55.16 129.14,54.53 129.14,37.64 V.2
N$29
  Bottom 0.406: 4.4 3.3
N$30
  Bottom 0.406: 5.4 4.3
N$31
  Bottom 0.406: 3.4 2.3
N$32  (via drill 0.4)
  Top 0.406: D4.C 219.63,95.81 218.04,97.39 205.66,97.39 204.71,96.44 v204.71,94.85
  Bottom 0.406: 2.4 v204.71,94.85 1.3
N$33
  Bottom 0.406: C.3 V.4
N$34
  Bottom 0.406: T.4 R.3
N$35
  Bottom 0.406: R.4 E.3
N$36
  Bottom 0.406: E.4 W.3
N$37
  Bottom 0.406: W.4 Q.3
N$38
  Bottom 0.406: F.3 G.4
N$39
  Bottom 0.406: D.3 F.4
N$40
  Bottom 0.406: S.3 D.4
N$41
  Bottom 0.406: A.3 S.4
N$42
  Bottom 0.406: 0.4 9.3
N$43
  Bottom 0.406: J.2 88.5,53.26 91.04,50.72 91.04,36.37 N.1
N$44
  Bottom 0.406: U.2 89.71,68.12 81.83,60.24 81.83,55.74 J.1
N$45
  Bottom 0.406: 7.2 98.66,91.04 86.92,79.3 86.92,75.1 U.1
N$46
  Bottom 0.406: K.2 68.82,53.26 71.67,50.4 71.67,36.05 M.1
N$47
  Bottom 0.406: I.2 70.98,69.07 62.47,60.56 62.47,55.42 K.1
N$48
  Bottom 0.406: 8.2 80.18,90.98 68.18,78.98 68.18,75.1 I.1
N$49
  Bottom 0.406: L.2 46.27,53.26 41.51,48.5 29.77,48.5 22.14,40.88 22.14,32.88 SYMB.1
N$50
  Bottom 0.406: O.2 51.93,68.44 44.05,60.56 44.05,55.42 L.1
N$51
  Bottom 0.406: 9.2 61.13,90.98 48.81,78.66 48.81,74.79 O.1
N$53
  Bottom 0.406: P.2 33.48,72.22 30.4,69.14 13.89,69.14 8.49,63.74 8.49,62.53 ENTER.1
N$54
  Bottom 0.406: 0.2 43.04,90.66 30.4,78.03 30.4,74.85 30.08,74.53 | 30.08,74.53 P.1 27.86,72.31 25,72.31 19.22,78.09 BREAK.2 | DELETE.2 246.3,72.31 225.66,51.67 219.63,51.67 215.82,55.48 213.6,55.48 209.15,59.93 209.15,69.77 205.34,73.58 200.58,73.58 197.72,70.72 190.74,70.72 188.2,73.26 182.16,73.26 179.62,70.72 168.83,70.72 166.29,73.26 162.8,73.26 160.57,71.04 156.13,71.04 153.59,73.58 144.38,73.58 141.84,71.04 133.91,71.04 131.37,73.58 125.97,73.58 119.3,66.91 119.3,55.8 118.67,55.16 112.95,55.16 111.36,56.75 111.36,72.63 110.09,73.9 107.23,73.9 104.06,70.72 97.08,70.72 93.9,73.9 87.87,73.9 85.01,71.04 76.44,71.04 73.58,73.9 69.14,73.9 66.28,71.04 56.12,71.04 53.26,73.9 50.4,73.9 47.55,71.04 38.02,71.04 34.53,74.53 30.08,74.53
N$55
  Bottom 0.406: 9.4 8.3
N$56
  Bottom 0.406: 8.4 7.3
N$57
  Bottom 0.406: 7.4 6.3
N$58
  Bottom 0.406: C.4 151.69,38.02 154.54,35.16 161.91,35.16 X.3
N$59
  Bottom 0.406: X.4 Z.3
N$60  (via drill 0.4)
  Top 0.406: v17.38,38.02 159.62,38.02 172.32,25.32 209.47,25.32 214.55,30.4 v214.55,38.02 D5.C
  Bottom 0.406: Z.4 198.99,38.02 200.26,36.75 209.79,36.75 211.06,38.02 v214.55,38.02 CAPS1.3 | v17.38,38.02 CAPS.3
N$61
  Bottom 0.406: P.4 46.31,76.15 O.3
N$62
  Bottom 0.406: O.4 I.3
N$63
  Bottom 0.406: I.4 U.3
N$64
  Bottom 0.406: U.4 Y.3
N$65
  Bottom 0.406: ENTER.4 32.69,66.28 L.3
N$66
  Bottom 0.406: L.4 K.3
N$67
  Bottom 0.406: K.4 J.3
N$68
  Bottom 0.406: J.4 H.3
N$70  (via drill 0.4)
  Top 0.406: v64.69,35.48 64.37,35.16 D12.A 62.78,32.77 D11.A
  Bottom 0.406: M.3 68.5,38.02 65.96,35.48 v64.69,35.48 64.37,35.8 24.68,35.8 24.05,35.16 24.05,23.73 14.59,14.27 SYMB.4
N$71
  Bottom 0.406: M.4 N.3
N$72
  Bottom 0.406: N.4 B.3
N$73  (via drill 0.4)
  Top 0.406: D34.A 162.48,84.38 182.8,104.69 219.95,104.69 v245.98,78.66
  Bottom 0.406: v245.98,78.66 245.98,76.18 DELETE.4
N$74
  Top 0.406: D7.C 177.09,60.88 186.61,51.35 IC2.18
N$75
  Top 0.406: D8.C 184.71,60.56 191.06,54.21 191.06,50.09 189.78,48.81 IC2.16
N$77
  Top 0.406: IC2.14 189.78,46.27 192.64,49.13 192.64,54.53 186.61,60.56 D10.C
N$79  (via drill 0.4)
  Top 0.406: 101.84,31.67 D6.C 98.66,31.99 | 98.66,31.99 64.37,31.99 | R2.2 98.66,31.99 | D12.C 64.37,31.99 | 64.37,31.99 v51.04,31.99
  Bottom 0.406: v51.04,31.99 51.04,34.15 PERIOD.1
N$80
  Top 0.406: IC2.12 189.78,43.73 192.01,45.96 192.32,45.96 193.28,46.91 193.28,55.8 188.51,60.56 D13.C
N$81
  Top 0.406: D16.C 174.54,45.32 176.13,43.73 IC2.9
N$83  (via drill 0.4)
  Top 0.406: R3.2 92.31,30.08 90.26,28.03 D9.C 61.2,28.03 | D11.C 61.2,28.03 | 61.2,28.03 48.67,28.03 v35.8,15.16
  Bottom 0.406: COMMA.2 v35.8,15.16
N$84
  Top 0.406: D14.C 199.94,36.75 190.42,27.23 173.91,27.23 159.94,41.2 151.05,41.2 145.97,46.27 145.97,47.55 146.6,48.18 IC1.6
N$85
  Top 0.406: D18.C 179.46,75.66 178.35,76.75 176.45,76.75 175.81,76.12 175.81,55.8 175.5,55.48 175.5,47.23 176.45,46.27 IC2.7
N$86
  Top 0.406: IC1.3 149.46,51.99 150.41,52.94 150.41,54.53 156.45,60.56 159.94,60.56 169.15,69.77 D26.C
N$87
  Top 0.406: D27.A 144.24,54.53 IC1.1 156.34,62.89 | D28.A 165.76,72.31 156.34,62.89 | D31.A 157.89,61.34 156.34,62.89
N$88
  Top 0.406: IC2.5 177.4,48.81 176.13,50.09 176.13,54.85 176.77,55.48 181.21,55.48 185.34,51.35 185.34,42.47 186.61,41.2 192.64,41.2 195.18,43.73 195.18,56.12 190.42,60.88 D29.C
N$89
  Top 0.406: IC2.3 177.4,51.35 176.77,51.99 176.77,54.53 177.09,54.85 180.9,54.85 184.71,51.04 184.71,42.15 186.29,40.56 192.96,40.56 196.13,43.73 196.13,59.93 192.32,63.74 D30.C
N$90  (via drill 0.4)
  Top 0.406: D20.A D19.A D21.A D17.A | D20.A 178.67,38.97 172.32,45.32 158.99,45.32 | 158.99,45.32 152.64,45.32 150.41,47.55 150.41,49.77 149.46,50.72 IC1.4 | D15.A 158.99,45.32 | D25.A D24.A D23.A 194.23,49.94 v194.23,50.4 194.06,50.57 D22.A | D20.A 179.48,39.78 v179.31,39.92
  Bottom 0.406: v194.23,50.4 186.29,50.4 179.31,43.42 v179.31,39.92
N$91
  Bottom 0.406: CAPS1.1 211.06,34.21 209.79,35.48 193.59,35.48 192.64,36.43 188.2,36.43 187.56,37.07 187.56,43.42 188.2,44.05 | 118.98,29.45 30.97,29.45 CAPS.2 | SPACE.2 121.2,15.16 118.98,17.38 118.98,29.45 | A.2 189.44,44.08 188.23,44.08 188.2,44.05 | 188.2,44.05 188.2,48.18 187.56,48.81 185.97,48.81 185.34,48.18 185.34,33.89 183.75,32.3 178.99,32.3 176.13,29.45 118.98,29.45
N$108
  Top 0.406: D32.C 172,60.56 158.35,46.91 IC1.8
N$114
  Top 0.406: IC1.11 157.08,50.72 169.78,63.42 169.78,74.85 170.1,75.17 170.1,76.44 169.78,76.75 168.19,76.75 166.93,78.03 D33.C
QUOTES  (via drill 0.4)
  Top 0.406: IC1.12 156.45,51.99 v158.03,53.58 D31.C | v184.39,28.18 174.86,28.18 v162.48,40.56
  Bottom 0.406: QUOTES.3 200.9,18.97 190.1,29.77 185.97,29.77 v184.39,28.18 | v162.48,40.56 158.03,45.01 v158.03,53.58
RIGHT  (via drill 0.4)
  Top 0.406: D24.C 191.69,46.91 189.78,45.01 IC2.13 v186.93,45.01
  Bottom 0.406: RIGHT.3 170.74,18.97 182.16,30.4 183.75,30.4 186.93,33.58 v186.93,45.01
SEMICOLON  (via drill 0.4)
  Top 0.406: D28.C 170.56,61.34 157.4,48.18 v156.13,48.18 IC1.9 | v199.31,24.37 168.51,24.37 v156.13,36.75
  Bottom 0.406: SEMICOLON.3 219,18.97 213.6,24.37 v199.31,24.37 | v156.13,36.75 v156.13,48.18
TRUEV  (via drill 0.4)
  Top 0.406: 179.94,50.09 IC2.4 v180.9,50.09 182.8,48.18 182.8,38.19 D19.C
  Bottom 0.406: TRUEV.3 245.98,94.85 248.84,92 248.84,71.67 223.12,45.96 209.15,45.96 200.58,54.53 197.72,54.53 194.55,51.35 185.34,51.35 182.16,54.53 178.35,54.53 177.4,53.58 177.4,51.99 178.04,51.35 179.62,51.35 v180.9,50.09
UP  (via drill 0.4)
  Top 0.406: D23.C 189.64,47.55 IC2.15 v186.29,47.55
  Bottom 0.406: v186.29,47.55 185.97,47.23 185.97,33.58 183.75,31.35 179.31,31.35 170.42,22.46 121.2,22.46 119.62,20.88 119.62,18.02 121.52,16.11 123.43,16.11 123.75,15.79 123.75,14.53 123.43,14.21 74.22,14.21 71.99,16.43 67.61,16.43 UP.3
VCC  (via drill 0.4)
  Top 0.406: R3.1 R2.1 146.29,28.18 v154.86,36.75 | v182.8,74.53 v182.8,69.14 182.8,58.34 187.25,53.9 IC2.20 | v168.83,67.87 160.89,59.93 157.08,59.93 154.12,56.97 IC1.14 156.13,54.53 v156.76,53.9
  Bottom 0.406: JP3.1 209.79,95.17 206.93,92.31 205.66,92.31 198.68,85.33 198.68,75.17 197.72,74.22 183.12,74.22 v182.8,74.53 | v168.83,67.87 181.53,67.87 v182.8,69.14 | v154.86,36.75 154.86,48.5 156.76,50.4 v156.76,53.9